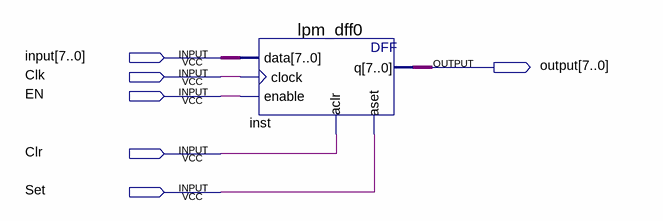
[diagram p0: schematic sheet]
// Quartus schematic test_dff.bdf as structural Verilog: 1 symbols, 6 pins
module test_dff (
  input  [7:0] \input ,
  input  Clk,
  input  EN,
  input  Clr,
  input  Set,
  output [7:0] \output 
);

  lpm_dff0 inst (.data(\input ), .clock(Clk), .enable(EN), .aclr(Clr), .aset(Set), .q(\output ));
endmodule
